# EAGLE design mosquino-power-template (EAGLE 5.08)
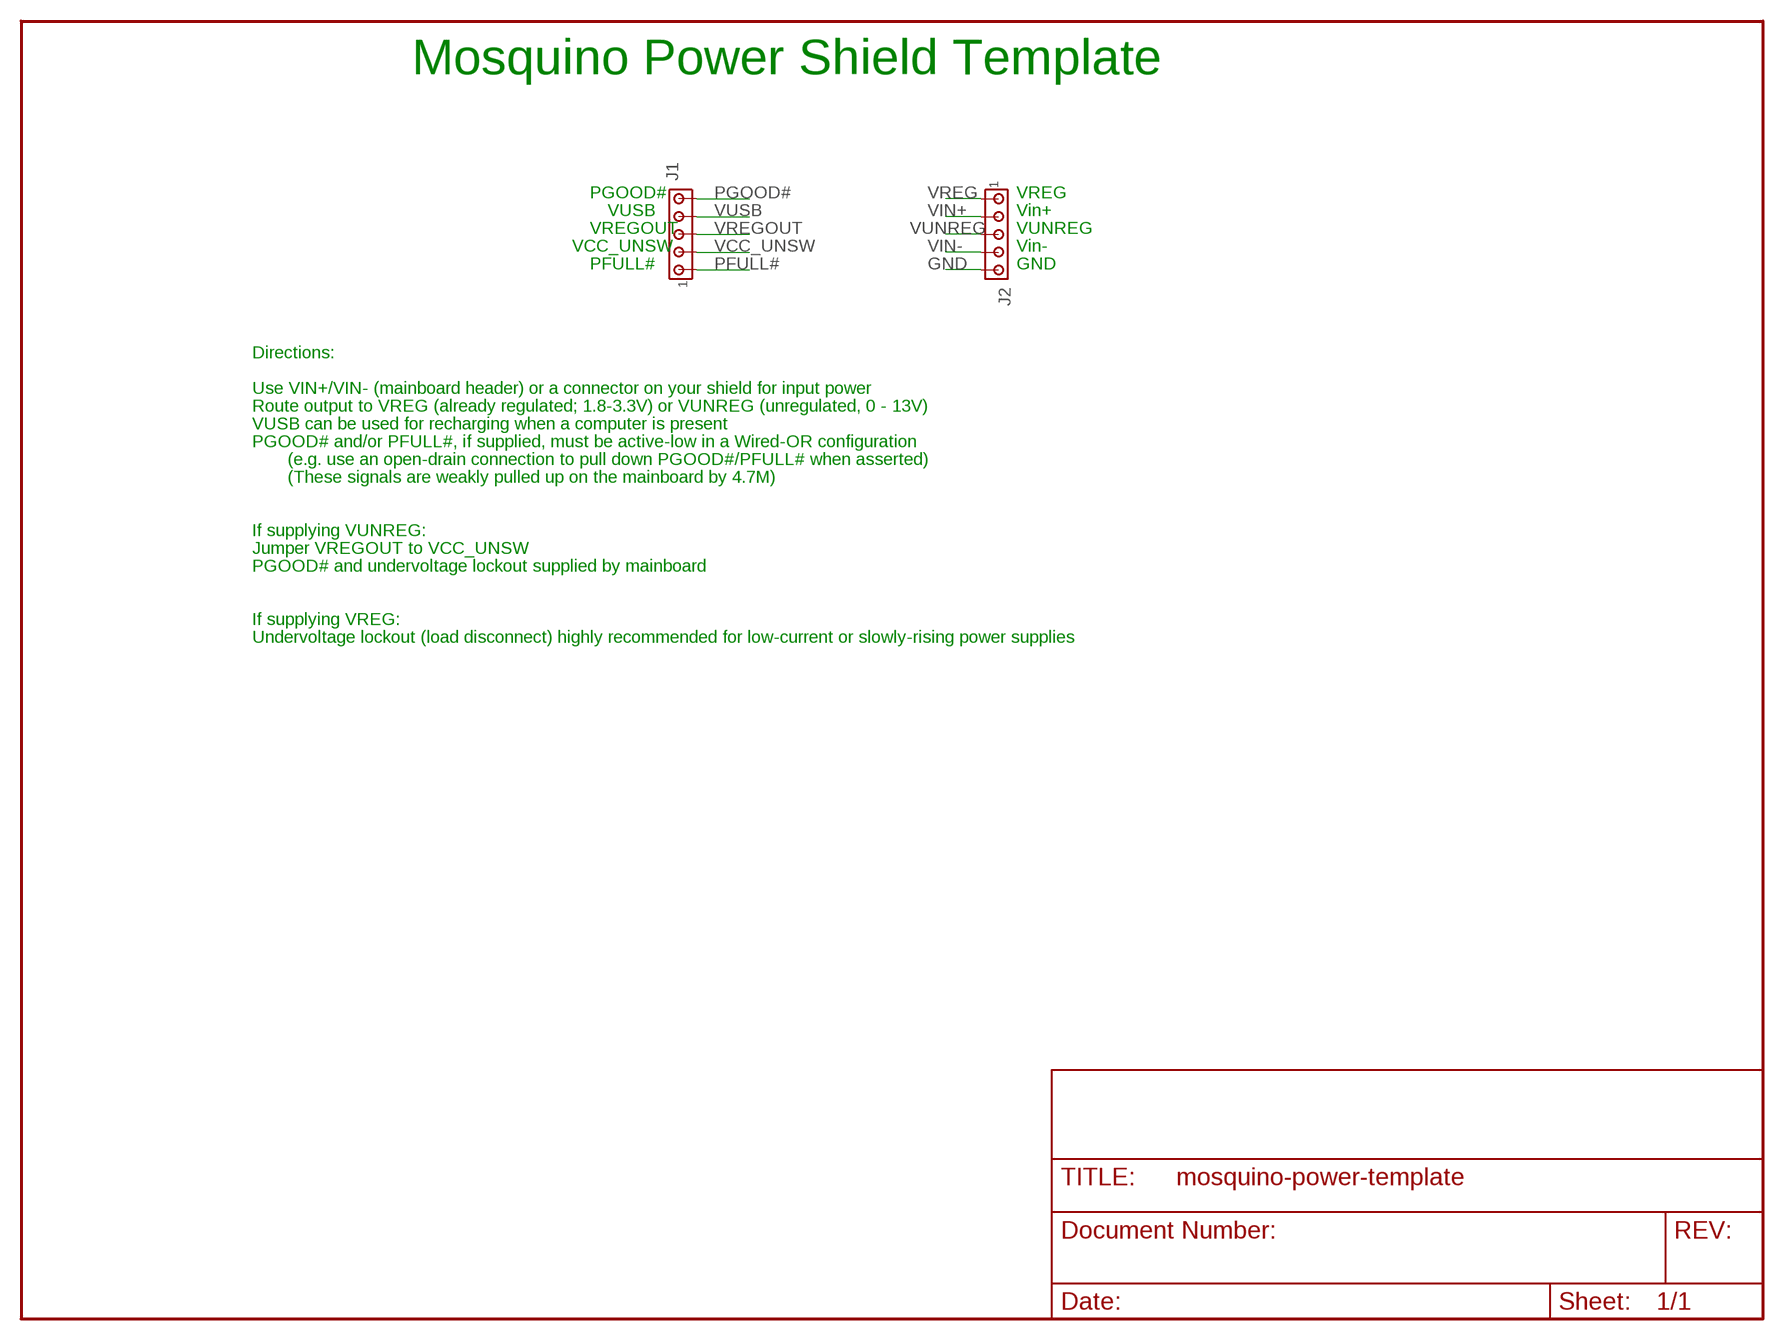
[diagram p0: schematic, sheet 1]

## Parts
J1  MTA05-100  [10X05MTA]
J2  MTA05-100  [10X05MTA]

## Nets
GND [pwr]: J2.5
PFULL#: J1.1
PGOOD#: J1.5
VCC_UNSW: J1.2
VIN+ [pwr]: J2.2
VIN- [pwr]: J2.4
VREG [pwr]: J2.1
VREGOUT: J1.3
VUNREG: J2.3
VUSB: J1.4

## Notes on the sheet
- Mosquino Power Shield Template
- PGOOD# | VREG
- VUSB | Vin+
- VREGOUT | VUNREG
- VCC_UNSW | Vin-
- PFULL# | GND
- Directions:
- Use VIN+/VIN- (mainboard header) or a connector on your shield for input power
- Route output to VREG (already regulated; 1.8-3.3V) or VUNREG (unregulated, 0 - 13V)
- VUSB can be used for recharging when a computer is present
- PGOOD# and/or PFULL#, if supplied, must be active-low in a Wired-OR configuration
- (e.g. use an open-drain connection to pull down PGOOD#/PFULL# when asserted)
- (These signals are weakly pulled up on the mainboard by 4.7M)
- If supplying VUNREG:
- Jumper VREGOUT to VCC_UNSW
- PGOOD# and undervoltage lockout supplied by mainboard
- If supplying VREG:
- Undervoltage lockout (load disconnect) highly recommended for low-current or slowly-rising power supplies

## Library data of the parts
J1 J2 = con-amp:MTA05-100: AMP connector

## Net classes
0 default: width 0.203 mm
1 pwr: width 0.203 mm, drill 0.381 mm, clearance 0.203 mm
4 digital: width 0.203 mm, drill 0.381 mm, clearance 0.203 mm

## Board
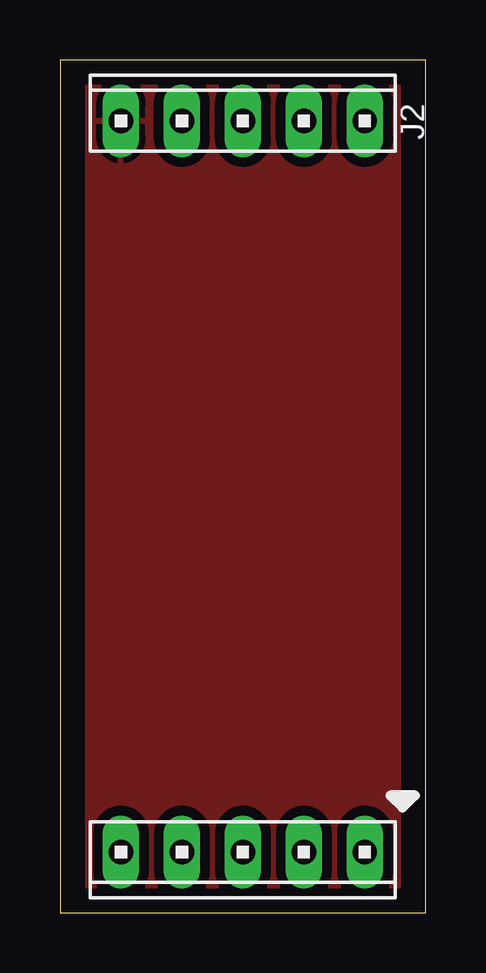
[diagram p1: board, top side]
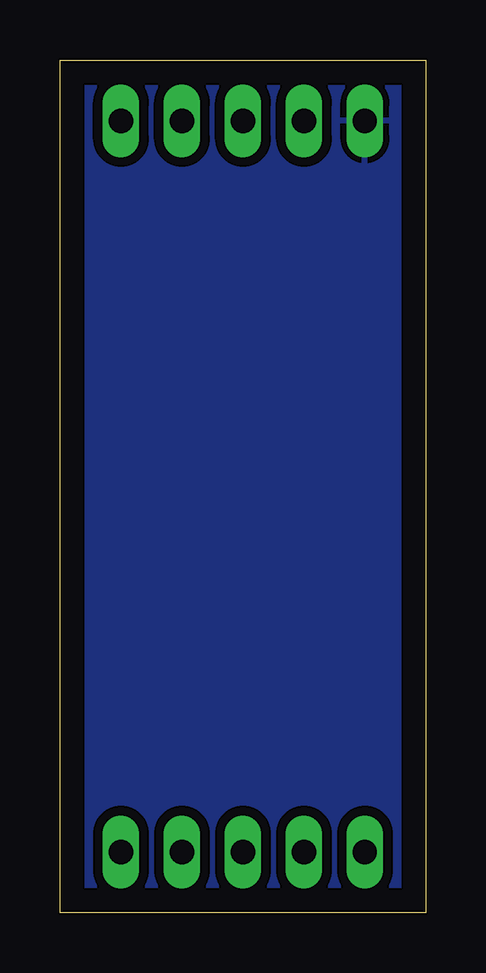
[diagram p2: board, bottom side, seen from below]

Size 15.24 x 35.56 mm. Coordinates in mm from the lower left corner, seen from the top.
Outline: 15.24,35.56 0,35.56 0,0 15.24,0 15.24,35.56
Copper layers (1*16): Top 0.035mm / dielectric 1.5mm / Bottom 0.035mm
Design rules: minimum track width 8mil, minimum drill 15mil, track to track 8mil, track to pad 8mil, pad to pad 8mil, via to via 8mil, smd to smd 8mil, copper to edge 40mil, drill to drill 8mil, minimum pad ring 10mil, minimum via ring 8mil, stop-mask expansion 4mil, vias tented up to drill 0mil, thermal gap 10mil

### Footprints (pad centres in the part's own frame; a part is rotated, then mirrored left to right if it is on the bottom)
10X05MTA = drill 1.016 long: 1 5.08,0; 2 2.54,0; 3 0,0; 4 -2.54,0; 5 -5.08,0

### Placement (x,y rotation side)
J1  7.62,2.54 180 top
J2  7.62,33.02 0 top

### Tracks (layer width: path | path; a pad name or v marks a point on that pad's centre or on a via)
GND
  pour Top (isolate 0.406): 15.24,35.56 15.24,0 0,0 0,35.56
  pour Bottom (isolate 0.406): 0,35.56 0,0 15.24,0 15.24,35.56

### Text on the board
Document: GND | VIN- | VUNREG | VIN+ | VREG | PFULL | VCC_UNSW | VREGOUT | VUSB | PGOOD